# Altium project roneMotorBoard-v15.PrjPcb
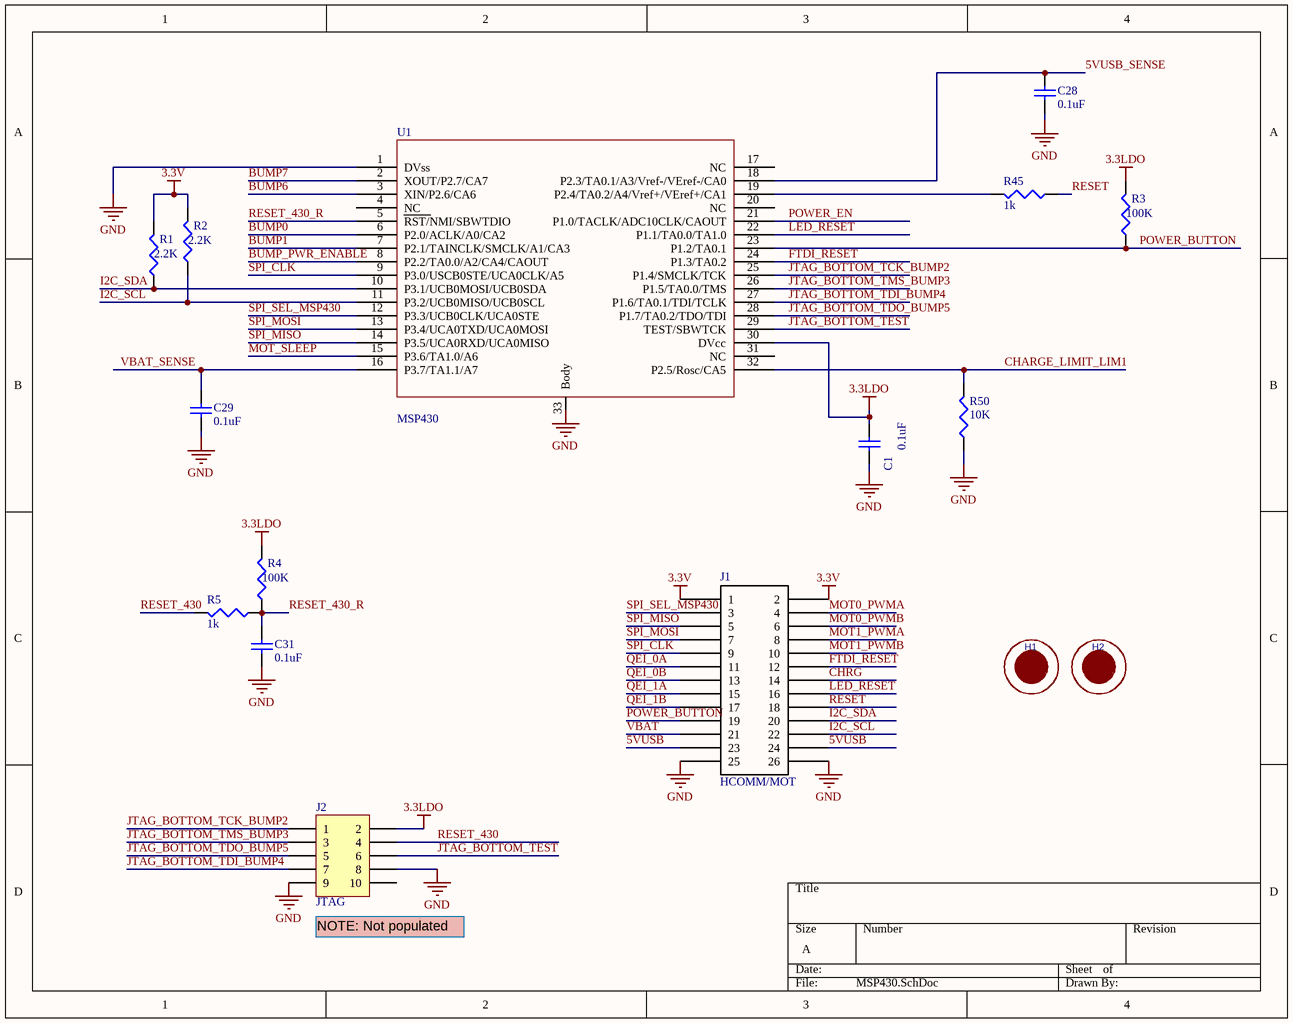
[diagram p0: MSP430.SchDoc]
Revision: V15
5 sheets, 109 parts. Net scope: global (net labels, ports and power ports of the same name join across sheets).
Board file: roneMotorBoard-v15.PcbDoc
Sheets:
  MSP430.SchDoc
  motorEncoder.SchDoc
  Power.SchDoc
  BumpSensors.SchDoc
  GyroAccel.SchDoc

## Sheet MSP430.SchDoc
size A; SheetNumber: roneV11-msp430; SheetTotal: 6

### Parts
C1  value 0.1uF  [CAPC1005L]  (hidden comment: Cap Semi)
C28  value 0.1uF  [CAPC1005L]  (hidden comment: Cap Semi)
C29  value 0.1uF  [CAPC1005L]  (hidden comment: Cap Semi)
C31  value 0.1uF  [CAPC1005L]  (hidden comment: Cap Semi)
H1  H_FID_F40  [F40]  (value not drawn)
H2  H_FID_F40  [F40]  (value not drawn)
J1  HCOMM/MOT  [HeaderSM 13x2]
J2  JTAG  [HDR2X5]
R1  value 2.2K  [RESC1608L]  (hidden comment: Res3)
R2  value 2.2K  [RESC1608L]  (hidden comment: Res3)
R3  value 100K  [RESC1608L]  (hidden comment: Res3)
R4  value 100K  [RESC1608L]  (hidden comment: Res3)
R5  value 1k  [RESC1608L]  (hidden comment: Res3)
R45  value 1k  [RESC1608L]  (hidden comment: Res3)
R50  value 10K  [RESC1608L]  (hidden comment: Res3)
U1  MSP430  [MSP430_32PIN]

### Nets
3.3LDO: C1.2 J2.2 R3.2 R4.2 U1.30(DVcc)
3.3V: J1.1 J1.2 R1.2 R2.2
5VUSB: J1.23 J1.24
GND: C1.1 C28.1 C29.1 C31.1 J1.25 J1.26 J2.8 J2.9 R50.1 U1.1(DVss) U1.33(Body)
VBAT: J1.21
5VUSB_SENSE: C28.2 U1.18(P2.3/TA0.1/A3/Vref-/VEref-/CA0)
BUMP0: U1.6(P2.0/ACLK/A0/CA2)
BUMP1: U1.7(P2.1/TAINCLK/SMCLK/A1/CA3)
BUMP6: U1.3(XIN/P2.6/CA6)
BUMP7: U1.2(XOUT/P2.7/CA7)
BUMP_PWR_ENABLE: U1.8(P2.2/TA0.0/A2/CA4/CAOUT)
CHARGE_LIMIT_LIM1: R50.2 U1.32(P2.5/Rosc/CA5)
CHRG: J1.14
FTDI_RESET: J1.12 U1.24(P1.3/TA0.2)
I2C_SCL: J1.22 R2.1 U1.11(P3.2/UCB0MISO/UCB0SCL)
I2C_SDA: J1.20 R1.1 U1.10(P3.1/UCB0MOSI/UCB0SDA)
JTAG_BOTTOM_TCK_BUMP2: J2.1 U1.25(P1.4/SMCLK/TCK)
JTAG_BOTTOM_TDI_BUMP4: J2.7 U1.27(P1.6/TA0.1/TDI/TCLK)
JTAG_BOTTOM_TDO_BUMP5: J2.5 U1.28(P1.7/TA0.2/TDO/TDI)
JTAG_BOTTOM_TEST: J2.6 U1.29(TEST/SBWTCK)
JTAG_BOTTOM_TMS_BUMP3: J2.3 U1.26(P1.5/TA0.0/TMS)
LED_RESET: J1.16 U1.22(P1.1/TA0.0/TA1.0)
MOT0_PWMA: J1.4
MOT0_PWMB: J1.6
MOT1_PWMA: J1.8
MOT1_PWMB: J1.10
MOT_SLEEP: U1.15(P3.6/TA1.0/A6)
POWER_BUTTON: J1.19 R3.1 U1.23(P1.2/TA0.1)
POWER_EN: U1.21(P1.0/TACLK/ADC10CLK/CAOUT)
QEI_0A: J1.11
QEI_0B: J1.13
QEI_1A: J1.15
QEI_1B: J1.17
RESET: J1.18 R45.1
RESET_430: J2.4 R5.2
RESET_430_R: C31.2 R4.1 R5.1 U1.5(RST/NMI/SBWTDIO)
SPI_CLK: J1.9 U1.9(P3.0/USCB0STE/UCA0CLK/A5)
SPI_MISO: J1.5 U1.14(P3.5/UCA0RXD/UCA0MISO)
SPI_MOSI: J1.7 U1.13(P3.4/UCA0TXD/UCA0MOSI)
SPI_SEL_MSP430: J1.3 U1.12(P3.3/UCB0CLK/UCA0STE)
VBAT_SENSE: C29.2 U1.16(P3.7/TA1.1/A7)
NetR45_2: R45.2 U1.19(P2.4/TA0.2/A4/Vref+/VEref+/CA1)

Not connected (* = marked no-connect by the designer): H1 1; H2 1; J2 10; U1 4(NC) 17(NC) 20(NC) 31(NC)

### Notes on the sheet
- (near J2) NOTE: Not populated

### Library data of the parts
C1 C28 C29 C31 = Cap Semi: Capacitor (Semiconductor SIM Model); Part Number: GRM155R71C104KA88D; Manufacturer: Murata; Published: 8-Jun-2000; LatestRevisionDate: 29-May-2009; LatestRevisionNote: IPC-7351 Footprint Added.; PackageReference: C1206; Publisher: Altium Limited; PackageDescription: Chip Capacitor
H1 H2 = H00083: FabLevel: Intrinsic; CPN: H00083; Rule: UNIONINDEX{}0[]RULEKIND{}ComponentClearance[]NETSCOPE{}AnyNet[]LAYERKIND{}SameLayer[]NAME{}Schematic Component Clearance Constraint[]GAP{}0.5mil[]COLLISIONCHECKMODE{}3[]VERTICALGAP{}10mil[]SHOWDISTANCES{}FALSE[]UNIT{}Imperial[]PcbType{}ProtelPcb; Title: Fiducial 0.040" - Helps assembly machines locate parts; Category Letter: H; Category: Hardware; HelpURL: https://rt3.ciholas.com/parts/H00083
J1 = HCOMM/HMOT: Header, 2X20, 50mil, IDC; Part Number: SHF-113-01-l-E-SM-LC; Manufacturer: Samtec
J2 = Header 5X2: Header, 5-Pin, Dual row; LatestRevisionDate: 17-Jul-2002; LatestRevisionNote: Re-released for DXP Platform.; Publisher: Altium Limited; DNI: DNI
R1 R2 = Res3: Resistor; Part Number: ERJ-3GEYJ-222V; Manufacturer: Panasonic; Published: 8-Jun-2000; LatestRevisionDate: 29-May-2009; LatestRevisionNote: IPC-7351 Footprint Added.; PackageReference: J1-0603; Publisher: Altium Limited; PackageDescription: Chip Resistor
R3 R4 = Res3: Resistor; Part Number: ERJ-3GEYJ104V; Manufacturer: Panasonic; Published: 8-Jun-2000; LatestRevisionDate: 29-May-2009; LatestRevisionNote: IPC-7351 Footprint Added.; PackageReference: J1-0603; Publisher: Altium Limited; PackageDescription: Chip Resistor
R5 R45 = Res3: Resistor; Part Number: ERJ-3GEYJ102V; Manufacturer: Panasonic; Published: 8-Jun-2000; LatestRevisionDate: 29-May-2009; LatestRevisionNote: IPC-7351 Footprint Added.; PackageReference: J1-0603; Publisher: Altium Limited; PackageDescription: Chip Resistor
R50 = Res3: Resistor; Part Number: 71-CRCW0603-10K-E3; Manufacturer: Vishay Dale; Published: 8-Jun-2000; LatestRevisionDate: 29-May-2009; LatestRevisionNote: IPC-7351 Footprint Added.; PackageReference: J1-0603; Publisher: Altium Limited; PackageDescription: Chip Resistor
U1 = MSP430_32pin: Part Number: MSP430F2132IRHBR; Manufacturer: TI

## Sheet motorEncoder.SchDoc: r-one Motor
size A; Date: 08/09/2011; DrawnBy: MRSL; Engineer: MRSL; Organization: Rice University; Revision: V11; SheetNumber: roneV11-motorEncoder; SheetTotal: 6; DocumentName: RoneV11-motorEncoder
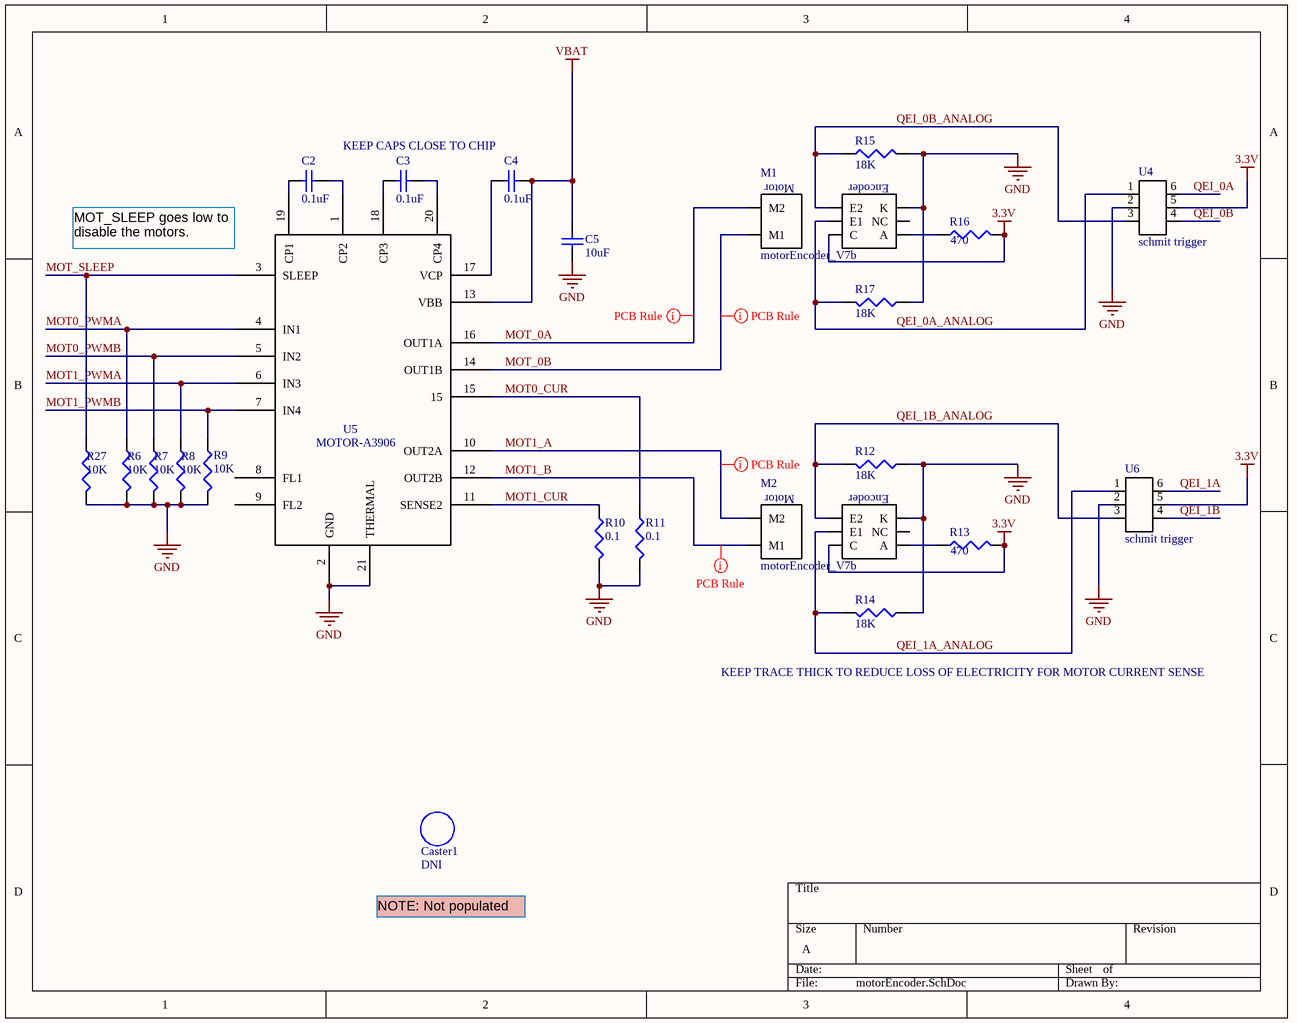
[diagram p1: motorEncoder.SchDoc]

### Parts
C2  value 0.1uF  [CAPC1005L]  (hidden comment: Cap Semi)
C3  value 0.1uF  [CAPC1005L]  (hidden comment: Cap Semi)
C4  value 0.1uF  [CAPC1005L]  (hidden comment: Cap Semi)
C5  value 10uF  [CAPC1608L]  (hidden comment: Cap Semi)
Caster1  non connect  [3/4"CASTER2]  (value not drawn)
M1  motorEncoder_V7b  [motorEncoder_V7b]
M2  motorEncoder_V7b  [motorEncoder_V7b]
R6  value 10K  [RESC1608L]  (hidden comment: Res3)
R7  value 10K  [RESC1608L]  (hidden comment: Res3)
R8  value 10K  [RESC1608L]  (hidden comment: Res3)
R9  value 10K  [RESC1608L]  (hidden comment: Res3)
R10  value 0.1  [RESC1608L]  (hidden comment: Res3)
R11  value 0.1  [RESC1608L]  (hidden comment: Res3)
R12  value 18K  [RESC1608L]
R13  value 470  [RESC1608L]
R14  value 18K  [RESC1608L]
R15  value 18K  [RESC1608L]
R16  value 470  [RESC1608L]
R17  value 18K  [RESC1608L]
R27  value 10K  [CAPC1608L]  (hidden comment: Res3)
U4  schmit trigger  [DCK(R-PDSO-C6)]
U5  MOTOR-A3906  [QFN-20]
U6  schmit trigger  [DCK(R-PDSO-C6)]

### Nets
3.3V: M1.C M2.C R13.2 R16.2 U4.5 U6.5
GND: C5.1 M1.K M2.K R6.2 R7.2 R8.2 R9.2 R10.2 R11.2 R12.1 R14.1 R15.2 R17.1 R27.2 U4.2 U5.2(GND) U5.21(THERMAL) U6.2
VBAT: C4.1 C5.2 U5.13(VBB)
MOT0_CUR: R11.1 U5.15
MOT0_PWMA: R6.1 U5.4(IN1)
MOT0_PWMB: R7.1 U5.5(IN2)
MOT1_A: M2.M2 U5.10(OUT2A)
MOT1_B: M2.M1 U5.12(OUT2B)
MOT1_CUR: R10.1 U5.11(SENSE2)
MOT1_PWMA: R8.1 U5.6(IN3)
MOT1_PWMB: R9.1 U5.7(IN4)
MOT_0A: M1.M2 U5.16(OUT1A)
MOT_0B: M1.M1 U5.14(OUT1B)
MOT_SLEEP: R27.1 U5.3(SLEEP)
QEI_0A: U4.6
QEI_0A_ANALOG: M1.E1 R17.2 U4.1
QEI_0B: U4.4
QEI_0B_ANALOG: M1.E2 R15.1 U4.3
QEI_1A: U6.6
QEI_1A_ANALOG: M2.E1 R14.2 U6.1
QEI_1B: U6.4
QEI_1B_ANALOG: M2.E2 R12.2 U6.3
NetC2_1: C2.1 U5.19(CP1)
NetC2_2: C2.2 U5.1(CP2)
NetC3_1: C3.1 U5.18(CP3)
NetC3_2: C3.2 U5.20(CP4)
NetC4_2: C4.2 U5.17(VCP)
NetM1_A: M1.A R16.1
NetM2_A: M2.A R13.1

Not connected (* = marked no-connect by the designer): M1 NC; M2 NC; U5 8(FL1) 9(FL2)

### Layout directives
rule Width Constraint [Pref Width = 20mil    Min Width = 10mil    Max Width = 25mil]: MOT1_A, MOT1_B, MOT_0A, MOT_0B

### Notes on the sheet
- KEEP CAPS CLOSE TO CHIP
- (near U5) MOT_SLEEP goes low to disable the motors.
- KEEP TRACE THICK TO REDUCE LOSS OF ELECTRICITY FOR MOTOR CURRENT SENSE
- NOTE: Not populated
- (in symbol motorEncoder_V7b) Motor; Encoder

### Library data of the parts
C2-C4 = Cap Semi: as C1 on sheet MSP430; Published: 8-Jun-2000; LatestRevisionDate: 29-May-2009; LatestRevisionNote: IPC-7351 Footprint Added.; PackageReference: C1206; Publisher: Altium Limited; PackageDescription: Chip Capacitor
C5 = Cap Semi: Capacitor (Semiconductor SIM Model); Part Number: GRM188R60J106ME47J; Manufacturer: Murata; Published: 8-Jun-2000; LatestRevisionDate: 29-May-2009; LatestRevisionNote: IPC-7351 Footprint Added.; PackageReference: C1206; Publisher: Altium Limited; PackageDescription: Chip Capacitor
Caster1 = Caster 3/4in: This is just a space saver to get the caster onto the pcb; Part Number: 955; Manufacturer: Pololu; DNI: DNI
M1 M2 = motorEncoder_V7b: Part Number: EE-SX1131; Manufacturer: Omron
R6-R9 R27 = Res3: as R50 on sheet MSP430; Published: 8-Jun-2000; LatestRevisionDate: 29-May-2009; LatestRevisionNote: IPC-7351 Footprint Added.; PackageReference: J1-0603; Publisher: Altium Limited; PackageDescription: Chip Resistor
R10 R11 = Res3: Resistor; Part Number: ERJ-3RSJR10V; Manufacturer: Panasonic; Published: 8-Jun-2000; LatestRevisionDate: 29-May-2009; LatestRevisionNote: IPC-7351 Footprint Added.; PackageReference: J1-0603; Publisher: Altium Limited; PackageDescription: Chip Resistor
R12 R14 R15 R17 = Res3: Resistor; Part Number: ERJ-3GEYJ183V; Manufacturer: Panasonic; Published: 8-Jun-2000; LatestRevisionDate: 29-May-2009; LatestRevisionNote: IPC-7351 Footprint Added.; PackageReference: J1-0603; Publisher: Altium Limited; PackageDescription: Chip Resistor
R13 R16 = Res3: Resistor; Part Number: ERJ-3GEYJ471V; Manufacturer: Panasonic; Published: 8-Jun-2000; LatestRevisionDate: 29-May-2009; LatestRevisionNote: IPC-7351 Footprint Added.; PackageReference: J1-0603; Publisher: Altium Limited; PackageDescription: Chip Resistor
U4 U6 = schmit trigger: Part Number: SN74LVC2G17QDCKRQ1; Manufacturer: TI
U5 = MOTOR-A3906: Part Number: A3906SESTR-T; Manufacturer: Allegro Micro Systems

## Sheet Power.SchDoc
size A; SheetNumber: roneV11-Power; SheetTotal: 6
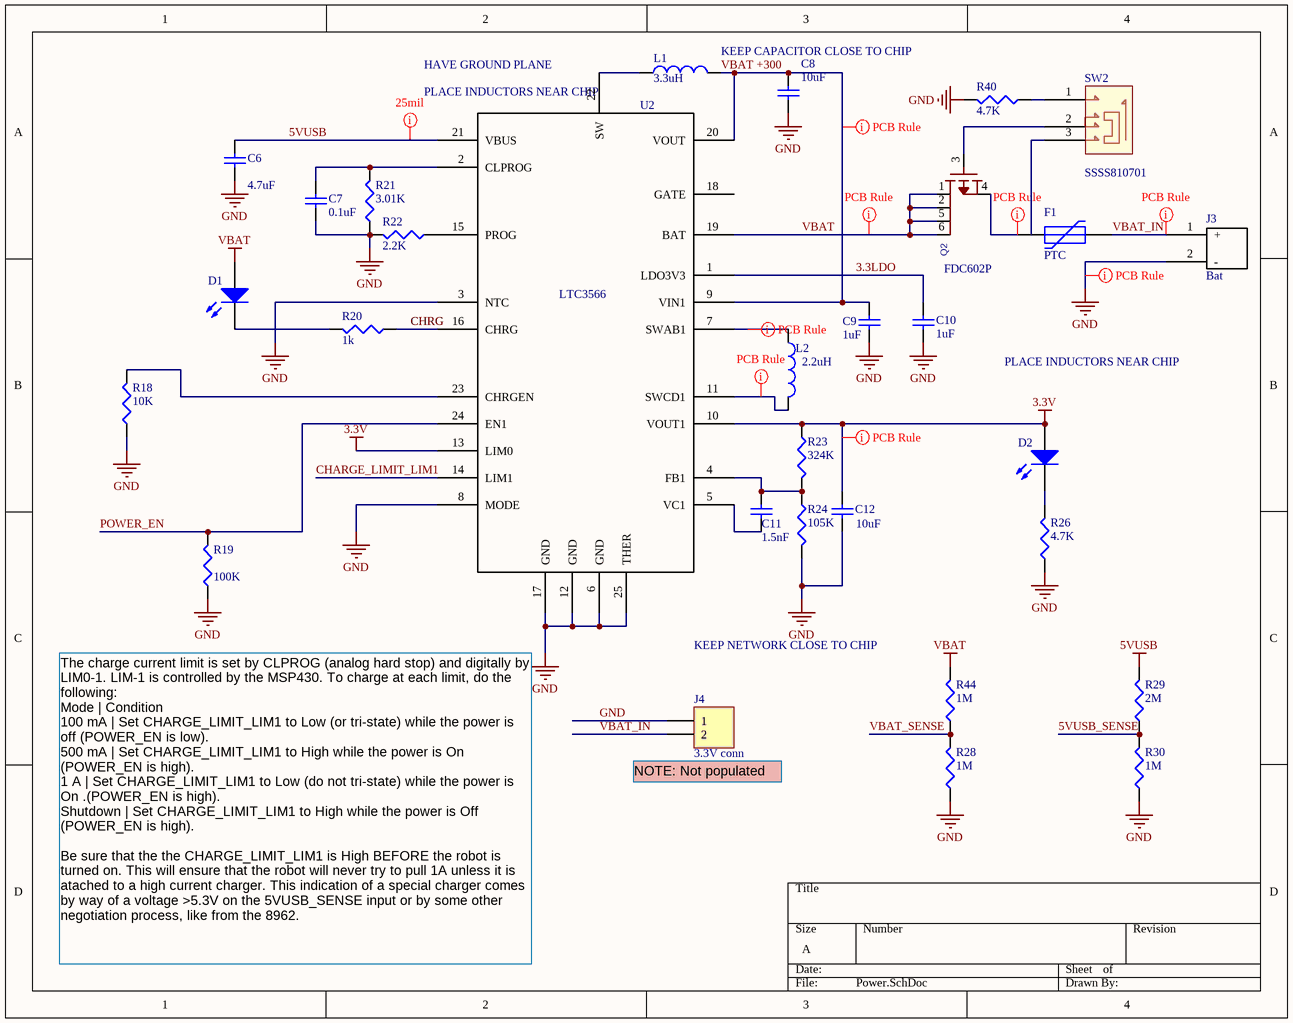
[diagram p2: Power.SchDoc]

### Parts
C6  value 4.7uF  [CAPC1608L]  (hidden comment: Cap Semi)
C7  value 0.1uF  [CAPC1005L]  (hidden comment: Cap)
C8  value 10uF  [CAPC1608L]  (hidden comment: Cap)
C9  value 1uF  [CAPC1608L]  (hidden comment: Cap)
C10  value 1uF  [CAPC1608L]  (hidden comment: Cap)
C11  value 1.5nF  [CAPC1005L]  (hidden comment: Cap)
C12  value 10uF  [CAPC1608L]  (hidden comment: Cap)
D1  Charge  [INDC2012L]  (value not drawn)
D2  Power  [INDC2012L]  (value not drawn)
F1  PTC  [ERJ8G-1206]
J3  Bat  [BatteryConnJST]
J4  3.3V conn  [HDR1X2]
L1  3.3uH  [IndPow]
L2  2.2uH  [IndPow]
Q2  Part Number: FDC602P  [SOT23-6]  (hidden comment: Q_MOSFETP4D_SOT23-6)
R18  value 10K  [RESC1608L]  (hidden comment: Res3)
R19  value 100K  [RESC1608L]  (hidden comment: Res3)
R20  value 1k  [RESC1608L]  (hidden comment: Res3)
R21  value 3.01K  [RESC1608L]  (hidden comment: Res3)
R22  value 2.2K  [RESC1608L]  (hidden comment: Res3)
R23  value 324K  [RESC1608L]  (hidden comment: Res3)
R24  value 105K  [RESC1608L]  (hidden comment: Res3)
R26  value 4.7K  [RESC1608L]  (hidden comment: Res3)
R28  value 1M  [RESC1608L]  (hidden comment: Res3)
R29  value 2M  [RESC1608L]  (hidden comment: Res3)
R30  value 1M  [RESC1608L]  (hidden comment: Res3)
R40  value 4.7K  [RESC1608L]  (hidden comment: Res3)
R44  value 1M  [RESC1608L]  (hidden comment: Res3)
SW2  S_SSSS810701_SSSS810701  [SSSS810701]  (value not drawn)
U2  LTC3566  [QFN-24]

### Nets
3.3LDO: C10.1 U2.1(LDO3V3)
3.3V: C12.2 D2.1(A) R23.1 U2.10(VOUT1) U2.13(LIM0)
5VUSB: C6.2 R29.2 U2.21(VBUS)
GND: C6.1 C7.1 C8.1 C9.2 C10.2 C12.1 J3.2(-) J4.1 R18.1 R19.1 R21.1 R22.2 R24.2 R26.1 R28.1 R30.1 R40.2 U2.3(NTC) U2.6(GND) U2.8(MODE) U2.12(GND) U2.17(GND) U2.25(THER)
VBAT: D1.1(A) Q2.1(D) Q2.2(D) Q2.5(D) Q2.6(D) R44.2 U2.19(BAT)
5VUSB_SENSE: R29.1 R30.2
CHARGE_LIMIT_LIM1: U2.14(LIM1)
CHRG: R20.1 U2.16(CHRG)
POWER_EN: R19.2 U2.24(EN1)
VBAT +300: C8.2 C9.1 L1.2 U2.9(VIN1) U2.20(VOUT)
VBAT_IN: F1.2 J3.1(+) J4.2
VBAT_SENSE: R28.2 R44.1
NetC7_2: C7.2 R21.2 U2.2(CLPROG)
NetC11_1: C11.1 R23.2 R24.1 U2.4(FB1)
NetC11_2: C11.2 U2.5(VC1)
NetD1_2: D1.2(K) R20.2
NetD2_2: D2.2(K) R26.2
NetF1_1: F1.1 Q2.4(S)
NetL1_1: L1.1 U2.22(SW)
NetL2_1: L2.1 U2.7(SWAB1)
NetL2_2: L2.2 U2.11(SWCD1)
NetQ2_3: Q2.3(G) SW2.2
NetR18_2: R18.2 U2.23(CHRGEN)
NetR22_1: R22.1 U2.15(PROG)
NetR40_1: R40.1 SW2.1

Not connected (* = marked no-connect by the designer): SW2 3; U2 18(GATE)

### Layout directives
rule Width Constraint [Pref Width = 25mil    Min Width = 10mil    Max Width = 25mil]: 5VUSB, GND, NetL2_1, NetL2_2, VBAT +300
rule Width Constraint [Pref Width = 25mil    Min Width = 10mil    Max Width = 100mil]: 3.3V
rule Width Constraint [Pref Width = 25mil    Min Width = 10mil    Max Width = 50mil]: NetF1_1, VBAT
rule Width Constraint [Pref Width = 25mil    Min Width = 10mil    Max Width = 40mil]: VBAT_IN

### Notes on the sheet
- (near U2) HAVE GROUND PLANE
- (near U2) PLACE INDUCTORS NEAR CHIP
- KEEP CAPACITOR CLOSE TO CHIP
- CHRG
- PLACE INDUCTORS NEAR CHIP
- KEEP NETWORK CLOSE TO CHIP
- (near J4) NOTE: Not populated
- The charge current limit is set by CLPROG (analog hard stop) and digitally by LIM0-1. LIM-1 is controlled by the MSP430. To charge at each limit, do the following:
  Mode	| Condition
  100 mA	| Set CHARGE_LIMIT_LIM1 to Low (or tri-state) while the power is off (POWER_EN is low).
  500 mA	| Set CHARGE_LIMIT_LIM1 to High while the power is On (POWER_EN is high).
  1 A	| Set CHARGE_LIMIT_LIM1 to Low (do not tri-state) while the power is On .(POWER_EN is high).
  Shutdown | Set CHARGE_LIMIT_LIM1 to High while the power is Off (POWER_EN is high).
  Be sure that the the CHARGE_LIMIT_LIM1 is High BEFORE the robot is turned on. This will ensure that the robot will never try to pull 1A unless it is atached to a high current charger. This indication of a special charger comes by way of a voltage >5.3V on the 5VUSB_SENSE input or by some other negotiation process, like from the 8962.

### Library data of the parts
C6 = Cap Semi: Capacitor (Semiconductor SIM Model); Part Number: JMK107BJ475KA-T; Manufacturer: Taiyo Yuden; Published: 8-Jun-2000; LatestRevisionDate: 29-May-2009; LatestRevisionNote: IPC-7351 Footprint Added.; PackageReference: C1206; Publisher: Altium Limited; PackageDescription: Chip Capacitor
C7 = Cap: Capacitor; Part Number: GRM155R71C104KA88D; Manufacturer: Murata; Published: 8-Jun-2000; LatestRevisionDate: 17-Jul-2002; LatestRevisionNote: Re-released for DXP Platform.; PackageReference: RAD-0.3; Publisher: Altium Limited
C8 C12 = Cap: Capacitor; Part Number: GRM188R60J106ME47J; Manufacturer: Murata; Published: 8-Jun-2000; LatestRevisionDate: 17-Jul-2002; LatestRevisionNote: Re-released for DXP Platform.; PackageReference: RAD-0.3; Publisher: Altium Limited
C9 C10 = Cap: Capacitor; Part Number: LMK107B7105KA-T; Manufacturer: Taiyo Yuden; Published: 8-Jun-2000; LatestRevisionDate: 17-Jul-2002; LatestRevisionNote: Re-released for DXP Platform.; PackageReference: RAD-0.3; Publisher: Altium Limited
C11 = Cap: Capacitor; Part Number: GRM155R71H152KA01D; Manufacturer: Murata; Published: 8-Jun-2000; LatestRevisionDate: 17-Jul-2002; LatestRevisionNote: Re-released for DXP Platform.; PackageReference: RAD-0.3; Publisher: Altium Limited
D1 = LED2: Typical RED, GREEN, YELLOW, AMBER GaAs LED; Part Number: LTST-C190AKT; Manufacturer: Lite-on; Published: 8-Jun-2000; LatestRevisionDate: 17-Jul-2002; LatestRevisionNote: Re-released for DXP Platform.; PackageVersion: Feb-2002; PackageReference: 3.2X1.6X1.1; Publisher: Altium Limited
D2 = LED2: Typical RED, GREEN, YELLOW, AMBER GaAs LED; Part Number: LS Q976-nR-1; Manufacturer: Osram; Published: 8-Jun-2000; LatestRevisionDate: 17-Jul-2002; LatestRevisionNote: Re-released for DXP Platform.; PackageVersion: Feb-2002; PackageReference: 3.2X1.6X1.1; Publisher: Altium Limited
F1 = PTC_FUSE: Fuse; Part Number: MF-NSMF200-2; Manufacturer: Bourns; Published: 8-Jun-2000; LatestRevisionDate: 17-Jul-2002; LatestRevisionNote: Re-released for DXP Platform.; PackageReference: PIN-W2/E2.8; Publisher: Altium Limited
J3 = BatteryConnJST: Part Number: B2B-PH-K-S(LF)(SN); Manufacturer: JST
J4 = Header 2: Header, 2-Pin; LatestRevisionDate: 17-Jul-2002; LatestRevisionNote: Re-released for DXP Platform.; Publisher: Altium Limited; DNI: DNI
L1 = Inductor: Part Number: LPS 4018-332MLB; Manufacturer: Coilcraft; Value: 3.3uH
L2 = Inductor: Part Number: LPS 4018-222MLB; Manufacturer: Coilcraft; Value: 2.2uH
Q2 = Q00101: Manufacturer: Fairchild; CPN: Q00101; Rating: -20V -5.5A; Title: Mosfet P-CH -20V -5.5A .035 Ohm SOT23-6; Category Letter: Q; Category: Transistor; HelpURL: https://rt3.ciholas.com/parts/Q00101; Supplier 2: Newark; Supplier Part Number 2: 58K8817; Supplier 3: Mouser; Supplier Part Number 3: 512-FDC602P
R18 = Res3: as R50 on sheet MSP430; Published: 8-Jun-2000; LatestRevisionDate: 29-May-2009; LatestRevisionNote: IPC-7351 Footprint Added.; PackageReference: J1-0603; Publisher: Altium Limited; PackageDescription: Chip Resistor
R19 = Res3: as R3 on sheet MSP430; Published: 8-Jun-2000; LatestRevisionDate: 29-May-2009; LatestRevisionNote: IPC-7351 Footprint Added.; PackageReference: J1-0603; Publisher: Altium Limited; PackageDescription: Chip Resistor
R20 = Res3: as R5 on sheet MSP430; Published: 8-Jun-2000; LatestRevisionDate: 29-May-2009; LatestRevisionNote: IPC-7351 Footprint Added.; PackageReference: J1-0603; Publisher: Altium Limited; PackageDescription: Chip Resistor
R21 = Res3: Resistor; Part Number: RMCF0603FT3K01; Manufacturer: Stackpole; Published: 8-Jun-2000; LatestRevisionDate: 29-May-2009; LatestRevisionNote: IPC-7351 Footprint Added.; PackageReference: J1-0603; Publisher: Altium Limited; PackageDescription: Chip Resistor
R22 = Res3: as R1 on sheet MSP430; Published: 8-Jun-2000; LatestRevisionDate: 29-May-2009; LatestRevisionNote: IPC-7351 Footprint Added.; PackageReference: J1-0603; Publisher: Altium Limited; PackageDescription: Chip Resistor
R23 = Res3: Resistor; Part Number: RC0603FR-07324KL; Manufacturer: Yageo; Published: 8-Jun-2000; LatestRevisionDate: 29-May-2009; LatestRevisionNote: IPC-7351 Footprint Added.; PackageReference: J1-0603; Publisher: Altium Limited; PackageDescription: Chip Resistor
R24 = Res3: Resistor; Part Number: RMCF 1/16 105K 1% R; Manufacturer: Stackpole; Published: 8-Jun-2000; LatestRevisionDate: 29-May-2009; LatestRevisionNote: IPC-7351 Footprint Added.; PackageReference: J1-0603; Publisher: Altium Limited; PackageDescription: Chip Resistor
R26 R40 = Res3: Resistor; Part Number: ERJ-3GEYJ472V; Manufacturer: Panasonic; Published: 8-Jun-2000; LatestRevisionDate: 29-May-2009; LatestRevisionNote: IPC-7351 Footprint Added.; PackageReference: J1-0603; Publisher: Altium Limited; PackageDescription: Chip Resistor
R28 R44 = Res3: Resistor; Part Number: ERJ-3GEY-J105V; Manufacturer: Panasonic; Published: 8-Jun-2000; LatestRevisionDate: 29-May-2009; LatestRevisionNote: IPC-7351 Footprint Added.; PackageReference: J1-0603; Publisher: Altium Limited; PackageDescription: Chip Resistor
R29 R30 = Res3: Resistor; Part Number: ERJ-3GEY-J205V; Manufacturer: Panasonic; Published: 8-Jun-2000; LatestRevisionDate: 29-May-2009; LatestRevisionNote: IPC-7351 Footprint Added.; PackageReference: J1-0603; Publisher: Altium Limited; PackageDescription: Chip Resistor
SW2 = S_SSSS810701_SSSS810701: SSSS810701; Manufacturer: Alps; FabLevel: SurfaceMount; Part Number: SSSS810701
U2 = LTC3566: Part Number: LTC3566EUF#PBF; Manufacturer: Linear

## Sheet BumpSensors.SchDoc
size A; SheetNumber: roneV11-BumpSensors; SheetTotal: 6
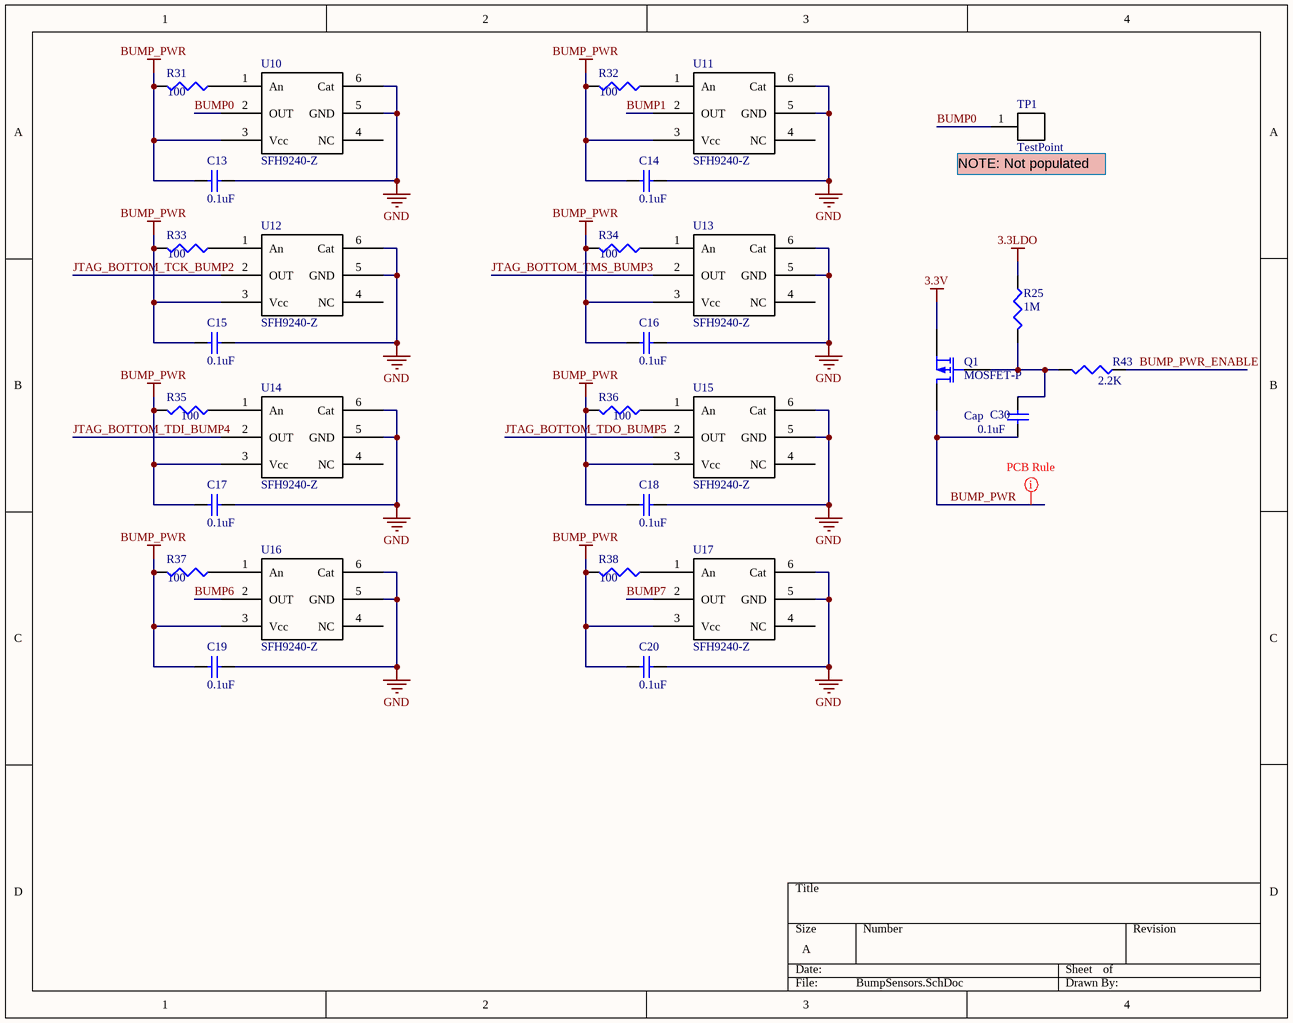
[diagram p3: BumpSensors.SchDoc]

### Parts
C13  value 0.1uF  [CAPC1005L]  (hidden comment: Cap Semi)
C14  value 0.1uF  [CAPC1005L]  (hidden comment: Cap Semi)
C15  value 0.1uF  [CAPC1005L]  (hidden comment: Cap Semi)
C16  value 0.1uF  [CAPC1005L]  (hidden comment: Cap Semi)
C17  value 0.1uF  [CAPC1005L]  (hidden comment: Cap Semi)
C18  value 0.1uF  [CAPC1005L]  (hidden comment: Cap Semi)
C19  value 0.1uF  [CAPC1005L]  (hidden comment: Cap Semi)
C20  value 0.1uF  [CAPC1005L]  (hidden comment: Cap Semi)
C30  Cap  value 0.1uF  [CAPC1005L]
Q1  MOSFET-P  [SOT-23]
R25  value 1M  [J1-0603]  (hidden comment: Res3)
R31  value 100  [RESC1608L]  (hidden comment: Res3)
R32  value 100  [RESC1608L]  (hidden comment: Res3)
R33  value 100  [RESC1608L]  (hidden comment: Res3)
R34  value 100  [RESC1608L]  (hidden comment: Res3)
R35  value 100  [RESC1608L]  (hidden comment: Res3)
R36  value 100  [RESC1608L]  (hidden comment: Res3)
R37  value 100  [RESC1608L]  (hidden comment: Res3)
R38  value 100  [RESC1608L]  (hidden comment: Res3)
R43  value 2.2K  [J1-0603]  (hidden comment: Res3)
TP1  TestPoint  [TestPoint]
U10  SFH9240-Z  [SFH9240-Z]
U11  SFH9240-Z  [SFH9240-Z]
U12  SFH9240-Z  [SFH9240-Z]
U13  SFH9240-Z  [SFH9240-Z]
U14  SFH9240-Z  [SFH9240-Z]
U15  SFH9240-Z  [SFH9240-Z]
U16  SFH9240-Z  [SFH9240-Z]
U17  SFH9240-Z  [SFH9240-Z]

### Nets
3.3LDO: R25.1
3.3V: Q1.2(S)
BUMP_PWR: C13.2 C14.2 C15.2 C16.2 C17.2 C18.2 C19.2 C20.2 C30.2 Q1.3(D) R31.2 R32.2 R33.2 R34.2 R35.2 R36.2 R37.2 R38.2 U10.3(Vcc) U11.3(Vcc) U12.3(Vcc) U13.3(Vcc) U14.3(Vcc) U15.3(Vcc) U16.3(Vcc) U17.3(Vcc)
GND: C13.1 C14.1 C15.1 C16.1 C17.1 C18.1 C19.1 C20.1 U10.5(GND) U10.6(Cat) U11.5(GND) U11.6(Cat) U12.5(GND) U12.6(Cat) U13.5(GND) U13.6(Cat) U14.5(GND) U14.6(Cat) U15.5(GND) U15.6(Cat) U16.5(GND) U16.6(Cat) U17.5(GND) U17.6(Cat)
BUMP0: TP1.1 U10.2(OUT)
BUMP1: U11.2(OUT)
BUMP6: U16.2(OUT)
BUMP7: U17.2(OUT)
BUMP_PWR_ENABLE: R43.1
JTAG_BOTTOM_TCK_BUMP2: U12.2(OUT)
JTAG_BOTTOM_TDI_BUMP4: U14.2(OUT)
JTAG_BOTTOM_TDO_BUMP5: U15.2(OUT)
JTAG_BOTTOM_TMS_BUMP3: U13.2(OUT)
NetC30_1: C30.1 Q1.1(G) R25.2 R43.2
NetR31_1: R31.1 U10.1(An)
NetR32_1: R32.1 U11.1(An)
NetR33_1: R33.1 U12.1(An)
NetR34_1: R34.1 U13.1(An)
NetR35_1: R35.1 U14.1(An)
NetR36_1: R36.1 U15.1(An)
NetR37_1: R37.1 U16.1(An)
NetR38_1: R38.1 U17.1(An)

Not connected (* = marked no-connect by the designer): U10 4(NC); U11 4(NC); U12 4(NC); U13 4(NC); U14 4(NC); U15 4(NC); U16 4(NC); U17 4(NC)

### Layout directives
rule Width Constraint [Pref Width = 15mil    Min Width = 10mil    Max Width = 15mil]: BUMP_PWR

### Notes on the sheet
- (near TP1) NOTE: Not populated

### Library data of the parts
C13-C20 = Cap Semi: as C1 on sheet MSP430; Published: 8-Jun-2000; LatestRevisionDate: 29-May-2009; LatestRevisionNote: IPC-7351 Footprint Added.; PackageReference: C1206; Publisher: Altium Limited; PackageDescription: Chip Capacitor
C30 = Cap: as C7 on sheet Power; Published: 8-Jun-2000; LatestRevisionDate: 17-Jul-2002; LatestRevisionNote: Re-released for DXP Platform.; PackageReference: RAD-0.3; Publisher: Altium Limited
Q1 = MOSFET-P: P-Channel MOSFET; Part Number: DMG2301U-7; Manufacturer: Diodes; Published: 8-Jun-2000; LatestRevisionDate: 17-Jul-2002; LatestRevisionNote: Re-released for DXP Platform.; PackageVersion: 1995/1996; PackageReference: E3; Publisher: Altium Limited
R25 = Res3: as R28 on sheet Power; Published: 8-Jun-2000; LatestRevisionDate: 29-May-2009; LatestRevisionNote: IPC-7351 Footprint Added.; PackageReference: J1-0603; Publisher: Altium Limited; PackageDescription: Chip Resistor
R31-R38 = Res3: Resistor; Part Number: ERJ-3GEYJ101V; Manufacturer: Panasonic; Published: 8-Jun-2000; LatestRevisionDate: 29-May-2009; LatestRevisionNote: IPC-7351 Footprint Added.; PackageReference: J1-0603; Publisher: Altium Limited; PackageDescription: Chip Resistor
R43 = Res3: Resistor; Part Number: ERJ-3GEYJ222V; Manufacturer: Panasonic; Published: 8-Jun-2000; LatestRevisionDate: 29-May-2009; LatestRevisionNote: IPC-7351 Footprint Added.; PackageReference: J1-0603; Publisher: Altium Limited; PackageDescription: Chip Resistor
U10-U17 = SFH9240-Z: Manufacturer: OSRAM; Part Number: SFH 9240-Z
TP1 = TestPoint: DNI: DNI

## Sheet GyroAccel.SchDoc
size A; SheetNumber: roneV11-GyroAccel; SheetTotal: 6
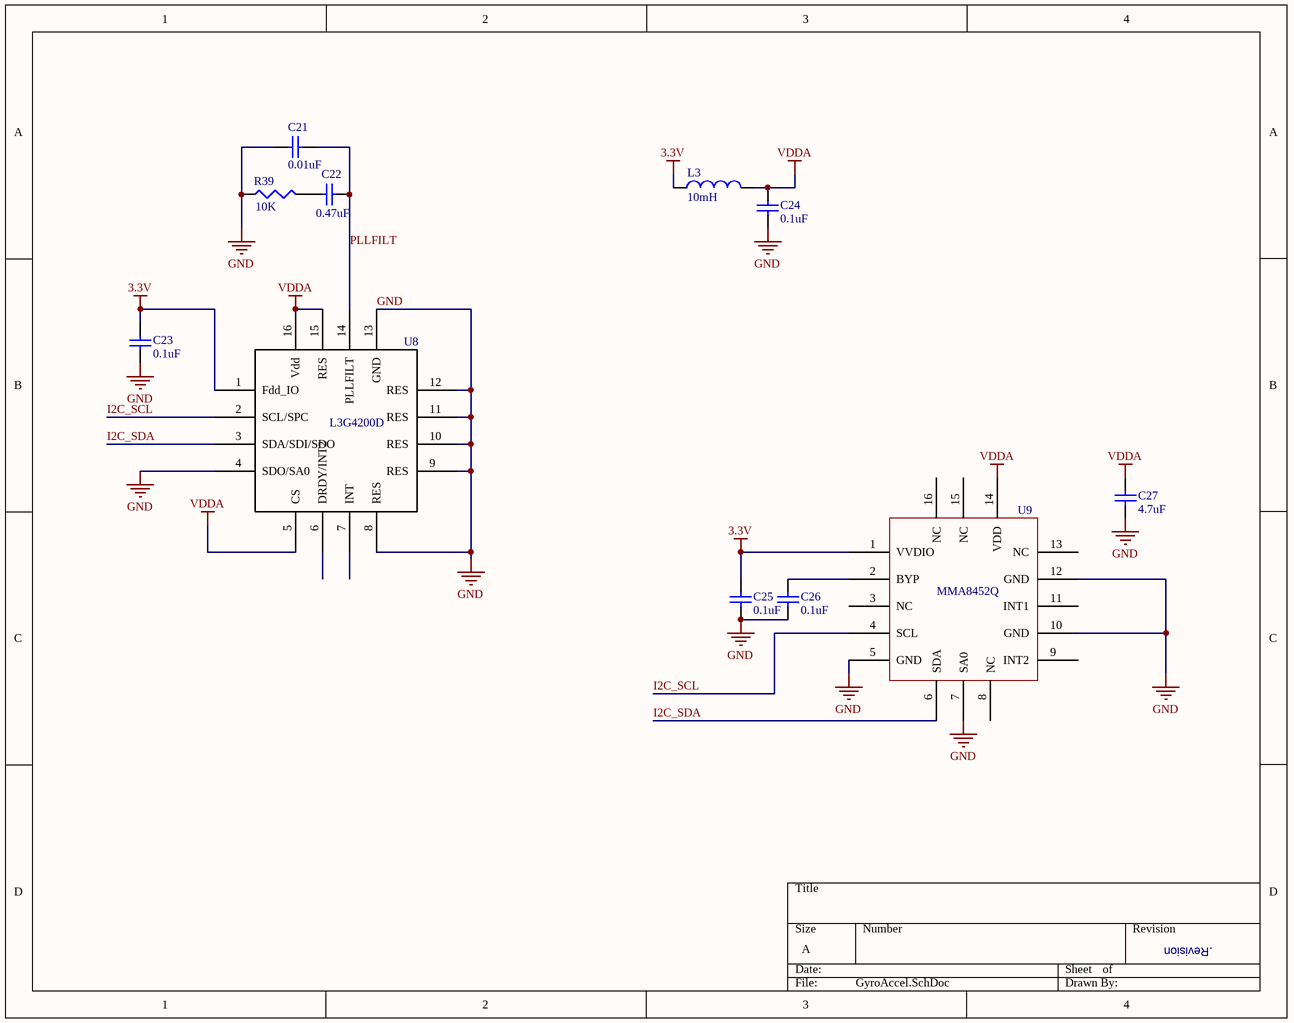
[diagram p4: GyroAccel.SchDoc]

### Parts
C21  value 0.01uF  [CAPC1005L]  (hidden comment: Cap Semi)
C22  value 0.47uF  [CAPC1005L]  (hidden comment: Cap Semi)
C23  value 0.1uF  [CAPC1005L]  (hidden comment: Cap Semi)
C24  value 0.1uF  [CAPC1005L]  (hidden comment: Cap Semi)
C25  value 0.1uF  [CAPC1005L]  (hidden comment: Cap Semi)
C26  value 0.1uF  [CAPC1005L]  (hidden comment: Cap Semi)
C27  value 4.7uF  [CAPC1608L]  (hidden comment: Cap Semi)
L3  value 10mH  [INDC2012L]  (hidden comment: Inductor)
R39  value 10K  [RESC1608L]  (hidden comment: Res3)
U8  L3G4200D  [L3G2004D]
U9  MMA8452Q  [MMA8452Q]

### Nets
3.3V: C23.2 C25.2 L3.2 U8.1(Fdd_IO) U9.1(VVDIO)
GND: C21.2 C23.1 C24.1 C25.1 C26.1 C27.1 R39.1 U8.4(SDO/SA0) U8.8(RES) U8.9(RES) U8.10(RES) U8.11(RES) U8.12(RES) U8.13(GND) U9.5(GND) U9.7(SA0) U9.10(GND) U9.12(GND)
VDDA: C24.2 C27.2 L3.1 U8.5(CS) U8.15(RES) U8.16(Vdd) U9.14(VDD)
I2C_SCL: U8.2(SCL/SPC) U9.4(SCL)
I2C_SDA: U8.3(SDA/SDI/SDO) U9.6(SDA)
PLLFILT: C21.1 C22.1 U8.14(PLLFILT)
NetC22_2: C22.2 R39.2
NetC26_2: C26.2 U9.2(BYP)

Not connected (* = marked no-connect by the designer): U8 6(DRDY/INT2) 7(INT); U9 3(NC) 8(NC) 9(INT2) 11(INT1) 13(NC) 15(NC) 16(NC)

### Notes on the sheet
- .Revision

### Library data of the parts
C21 = Cap Semi: Capacitor (Semiconductor SIM Model); Part Number: UMK105B7103KV-F; Manufacturer: Taiyo Yuden; Published: 8-Jun-2000; LatestRevisionDate: 29-May-2009; LatestRevisionNote: IPC-7351 Footprint Added.; PackageReference: C1206; Publisher: Altium Limited; PackageDescription: Chip Capacitor
C22 = Cap Semi: Capacitor (Semiconductor SIM Model); Part Number: GRM155F51C474ZA01D; Manufacturer: Murata; Published: 8-Jun-2000; LatestRevisionDate: 29-May-2009; LatestRevisionNote: IPC-7351 Footprint Added.; PackageReference: C1206; Publisher: Altium Limited; PackageDescription: Chip Capacitor
C23-C26 = Cap Semi: as C1 on sheet MSP430; Published: 8-Jun-2000; LatestRevisionDate: 29-May-2009; LatestRevisionNote: IPC-7351 Footprint Added.; PackageReference: C1206; Publisher: Altium Limited; PackageDescription: Chip Capacitor
C27 = Cap Semi: as C6 on sheet Power; Published: 8-Jun-2000; LatestRevisionDate: 29-May-2009; LatestRevisionNote: IPC-7351 Footprint Added.; PackageReference: C1206; Publisher: Altium Limited; PackageDescription: Chip Capacitor
L3 = Inductor: Part Number: MMZ2012R102A; Manufacturer: TDK; Code_IEC: 1005; Published: 8-Jun-2000; LatestRevisionDate: 29-May-2009; LatestRevisionNote: IPC-7351 Footprint Added.; PackageReference: 0402-A; Publisher: Altium Limited; PackageDescription: Chip Inductor; Code_JEITA: 0402
R39 = Res3: as R50 on sheet MSP430; Published: 8-Jun-2000; LatestRevisionDate: 29-May-2009; LatestRevisionNote: IPC-7351 Footprint Added.; PackageReference: J1-0603; Publisher: Altium Limited; PackageDescription: Chip Resistor
U8 = L3G4200D: 3axis gyroscope, SPI; Part Number: L3G4200DTR; Manufacturer: ST Mircoelectronics
U9 = MMA8452Q: Part Number: MMA8452QT; Manufacturer: Freescale Semiconductor

## Nets that join several sheets
3.3LDO: MSP430 (5 pins), Power (C10.1 U2.1), BumpSensors (R25.1)
3.3V: MSP430 (J1.1 J1.2 R1.2 R2.2), motorEncoder (6 pins), Power (5 pins), BumpSensors (Q1.2), GyroAccel (5 pins)
5VUSB: MSP430 (J1.23 J1.24), Power (C6.2 R29.2 U2.21)
GND: MSP430 (11 pins), motorEncoder (18 pins), Power (23 pins), BumpSensors (24 pins), GyroAccel (18 pins)
VBAT: MSP430 (J1.21), motorEncoder (C4.1 C5.2 U5.13), Power (7 pins)
5VUSB_SENSE: MSP430 (C28.2 U1.18), Power (R29.1 R30.2)
BUMP0: MSP430 (U1.6), BumpSensors (TP1.1 U10.2)
BUMP1: MSP430 (U1.7), BumpSensors (U11.2)
BUMP6: MSP430 (U1.3), BumpSensors (U16.2)
BUMP7: MSP430 (U1.2), BumpSensors (U17.2)
BUMP_PWR_ENABLE: MSP430 (U1.8), BumpSensors (R43.1)
CHARGE_LIMIT_LIM1: MSP430 (R50.2 U1.32), Power (U2.14)
CHRG: MSP430 (J1.14), Power (R20.1 U2.16)
I2C_SCL: MSP430 (J1.22 R2.1 U1.11), GyroAccel (U8.2 U9.4)
I2C_SDA: MSP430 (J1.20 R1.1 U1.10), GyroAccel (U8.3 U9.6)
JTAG_BOTTOM_TCK_BUMP2: MSP430 (J2.1 U1.25), BumpSensors (U12.2)
JTAG_BOTTOM_TDI_BUMP4: MSP430 (J2.7 U1.27), BumpSensors (U14.2)
JTAG_BOTTOM_TDO_BUMP5: MSP430 (J2.5 U1.28), BumpSensors (U15.2)
JTAG_BOTTOM_TMS_BUMP3: MSP430 (J2.3 U1.26), BumpSensors (U13.2)
MOT0_PWMA: MSP430 (J1.4), motorEncoder (R6.1 U5.4)
MOT0_PWMB: MSP430 (J1.6), motorEncoder (R7.1 U5.5)
MOT1_PWMA: MSP430 (J1.8), motorEncoder (R8.1 U5.6)
MOT1_PWMB: MSP430 (J1.10), motorEncoder (R9.1 U5.7)
MOT_SLEEP: MSP430 (U1.15), motorEncoder (R27.1 U5.3)
POWER_EN: MSP430 (U1.21), Power (R19.2 U2.24)
QEI_0A: MSP430 (J1.11), motorEncoder (U4.6)
QEI_0B: MSP430 (J1.13), motorEncoder (U4.4)
QEI_1A: MSP430 (J1.15), motorEncoder (U6.6)
QEI_1B: MSP430 (J1.17), motorEncoder (U6.4)
VBAT_SENSE: MSP430 (C29.2 U1.16), Power (R28.2 R44.1)